# EAGLE design transistor_dc_motor_driver (EAGLE 9.6.2)
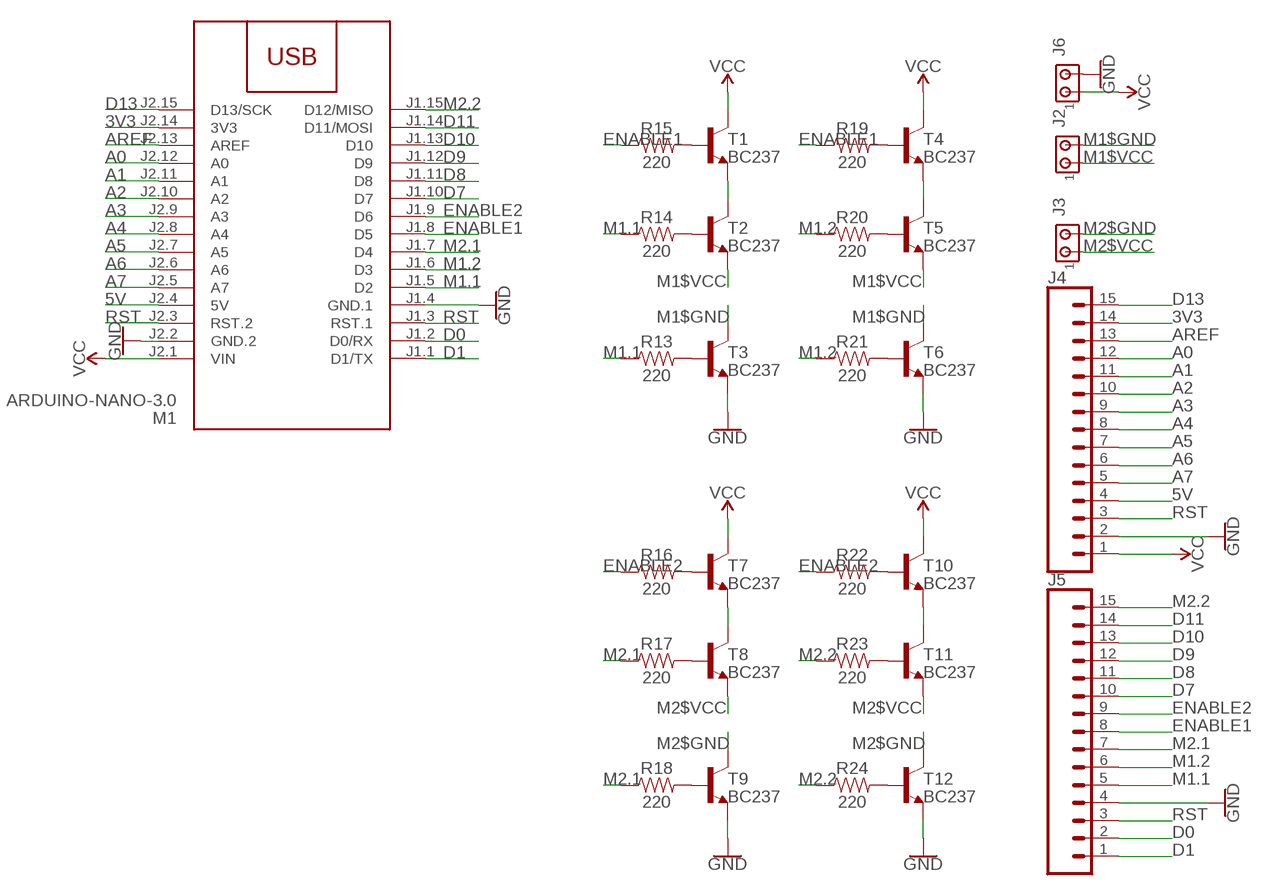
[diagram p0: schematic, sheet 1]

## Parts
J2  MTA02-156  [1X2MTA]
J3  MTA02-156  [1X2MTA]
J4  CONN_15  [1X15]
J5  CONN_15  [1X15]
J6  MTA02-156  [1X2MTA]
M1  ARDUINO-NANO-3.0  [ARDUINO-NANO-3.0]
R13  220  1KOHM-HORIZ-1/4W-5%  [AXIAL-0.3]
R14  220  1KOHM-HORIZ-1/4W-5%  [AXIAL-0.3]
R15  220  1KOHM-HORIZ-1/4W-5%  [AXIAL-0.3]
R16  220  1KOHM-HORIZ-1/4W-5%  [AXIAL-0.3]
R17  220  1KOHM-HORIZ-1/4W-5%  [AXIAL-0.3]
R18  220  1KOHM-HORIZ-1/4W-5%  [AXIAL-0.3]
R19  220  1KOHM-HORIZ-1/4W-5%  [AXIAL-0.3]
R20  220  1KOHM-HORIZ-1/4W-5%  [AXIAL-0.3]
R21  220  1KOHM-HORIZ-1/4W-5%  [AXIAL-0.3]
R22  220  1KOHM-HORIZ-1/4W-5%  [AXIAL-0.3]
R23  220  1KOHM-HORIZ-1/4W-5%  [AXIAL-0.3]
R24  220  1KOHM-HORIZ-1/4W-5%  [AXIAL-0.3]
T1  BC237  [TO92]
T2  BC237  [TO92]
T3  BC237  [TO92]
T4  BC237  [TO92]
T5  BC237  [TO92]
T6  BC237  [TO92]
T7  BC237  [TO92]
T8  BC237  [TO92]
T9  BC237  [TO92]
T10  BC237  [TO92]
T11  BC237  [TO92]
T12  BC237  [TO92]

## Nets
3V3: J4.14 M1.J2.14(3V3)
5V [5v]: J4.4 M1.J2.4(5V)
A0: J4.12 M1.J2.12(A0)
A1: J4.11 M1.J2.11(A1)
A2: J4.10 M1.J2.10(A2)
A3: J4.9 M1.J2.9(A3)
A4: J4.8 M1.J2.8(A4)
A5: J4.7 M1.J2.7(A5)
A6: J4.6 M1.J2.6(A6)
A7: J4.5 M1.J2.5(A7)
AREF: J4.13 M1.J2.13(AREF)
D0: J5.2 M1.J1.2(D0/RX)
D1: J5.1 M1.J1.1(D1/TX)
D7: J5.10 M1.J1.10(D7)
D8: J5.11 M1.J1.11(D8)
D9: J5.12 M1.J1.12(D9)
D10: J5.13 M1.J1.13(D10)
D11: J5.14 M1.J1.14(D11/MOSI)
D13: J4.15 M1.J2.15(D13/SCK)
ENABLE1: J5.8 M1.J1.8(D5) R15.P$1 R19.P$1
ENABLE2: J5.9 M1.J1.9(D6) R16.P$1 R22.P$1
GND [power]: J4.2 J5.4 J6.2 M1.J1.4(GND.1) M1.J2.2(GND.2) T3.1(E) T6.1(E) T9.1(E) T12.1(E)
M1$GND [power]: J2.2 T3.3(C) T6.3(C)
M1$VCC [power]: J2.1 T2.1(E) T5.1(E)
M1.1: J5.5 M1.J1.5(D2) R13.P$1 R14.P$1
M1.2: J5.6 M1.J1.6(D3) R20.P$1 R21.P$1
M2$GND [power]: J3.2 T9.3(C) T12.3(C)
M2$VCC [power]: J3.1 T8.1(E) T11.1(E)
M2.1: J5.7 M1.J1.7(D4) R17.P$1 R18.P$1
M2.2: J5.15 M1.J1.15(D12/MISO) R23.P$1 R24.P$1
N$1: T1.1(E) T2.3(C)
N$2: T7.1(E) T8.3(C)
N$3: T10.1(E) T11.3(C)
N$5: T4.1(E) T5.3(C)
N$6: R13.P$2 T3.2(B)
N$7: R14.P$2 T2.2(B)
N$8: R15.P$2 T1.2(B)
N$9: R16.P$2 T7.2(B)
N$10: R17.P$2 T8.2(B)
N$11: R18.P$2 T9.2(B)
N$12: R19.P$2 T4.2(B)
N$13: R20.P$2 T5.2(B)
N$14: R21.P$2 T6.2(B)
N$15: R22.P$2 T10.2(B)
N$16: R23.P$2 T11.2(B)
N$17: R24.P$2 T12.2(B)
RST: J4.3 J5.3 M1.J1.3(RST.1) M1.J2.3(RST.2)
VCC [power]: J4.1 J6.1 M1.J2.1(VIN) T1.3(C) T4.3(C) T7.3(C) T10.3(C)

## Library data of the parts
J2 J3 J6 = con-amp:MTA02-156: AMP connector
J4 J5 = SparkFun-Connectors:CONN_15: Multi connection point. Often used as Generic Header-pin footprint for 0.1 inch spaced/style header connections On any of the 0.1 inch spaced packages, you can populate with these: Break Away Headers - Straight <https://www.sparkfun.com/products/116> (PRT-00116) Break Away Male Headers - Right Angle <https://www.sparkfun.com/products/553> (PRT-00553) Female Headers <https://www.sparkfun.com/products/115> (PRT-00115) Break Away Headers - Machine Pin <https://www.sparkfun.com/products/117> (PRT-00117) Break Away Female Headers - Swiss Machine Pin <https://www.sparkfun.com/products/743> (PRT-00743) For SCREWTERMINALS and SPRING TERMINALS visit here: Screw Terimnals on SparkFun.com <https://www.sparkfun.com/search/results?term=Screw+Terminals> (5mm/3.5mm/2.54mm spacing) This device is also useful as a general connection point to wire up your design to another part of your project. Our various solder wires solder well into these plated through hole pads. Hook-Up Wire - Assortment (Stranded, 22 AWG) <https://www.sparkfun.com/products/11375> (PRT-11375) Hook-Up Wire - Assortment (Solid Core, 22 AWG) <https://www.sparkfun.com/products/11367> (PRT-11367) View the entire wire category on our website here <https://www.sparkfun.com/categories/141> Special notes: Molex polarized connector foot print use with SKU : PRT-08231 with associated crimp pins and housings. 1MM SMD Version SKU: PRT-10208 NOTES ON THE VARIANTS LOCK and LOCK_LONGPADS... This footprint was designed to help hold the alignment of a through-hole component (i.e. 6-pin header) while soldering it into place. You may notice that each hole has been shifted either up or down by 0.005 of an inch from it's more standard position (which is a perfectly straight line). This slight alteration caused the pins (the squares in the middle) to touch the edges of the holes. Because they are alternating, it causes a "brace" to hold the component in place. 0.005 has proven to be the perfect amount of "off-center" position when using our standard breakaway headers. Although looks a little odd when you look at the bare footprint, once you have a header in there, the alteration is very hard to notice. Also,if you push a header all the way into place, it is covered up entirely on the bottom side.
M1 = diy-modules:ARDUINO-NANO-3.0: Arduino Nano 3.0 and compatible devices More details available here: https://www.arduino.cc/en/Main/ArduinoBoardNano Click here to find device on ebay.com <http://www.ebay.com/sch/arduino+nano>
R13-R24 = SparkFun-Resistors:1KOHM: 1kΩ resistor A resistor is a passive two-terminal electrical component that implements electrical resistance as a circuit element. Resistors act to reduce current flow, and, at the same time, act to lower voltage levels within circuits. - Wikipedia; PROD_ID: RES-08380; VALUE: 1k
T1-T12 = transistor:BC237: NPN TRANSISTOR

## Net classes
0 default: width 0.305 mm, drill 0.508 mm, clearance 0.254 mm
1 power: width 0.889 mm, drill 0.508 mm, clearance 0.254 mm
2 5v: width 0.508 mm, drill 0.508 mm, clearance 0.254 mm

## Board
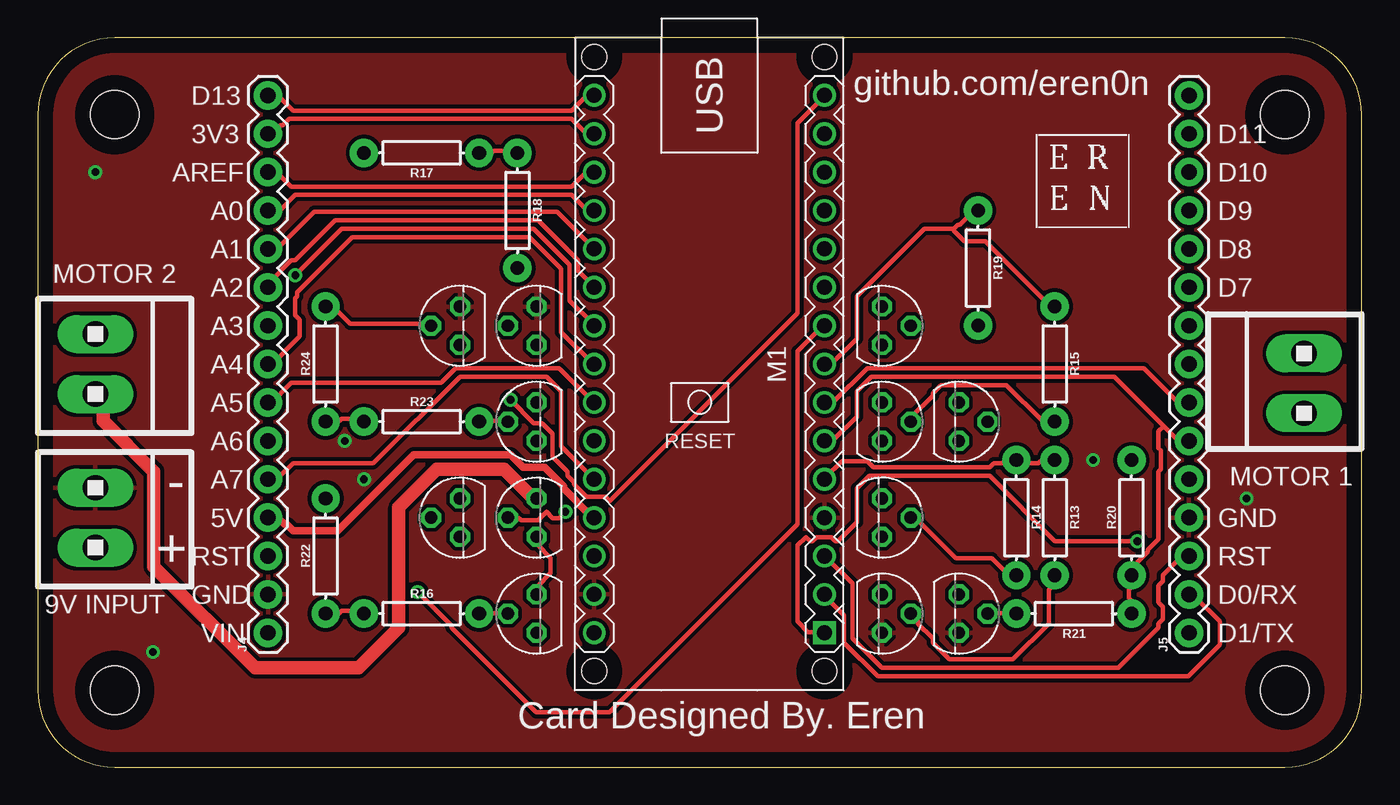
[diagram p1: board, top side]
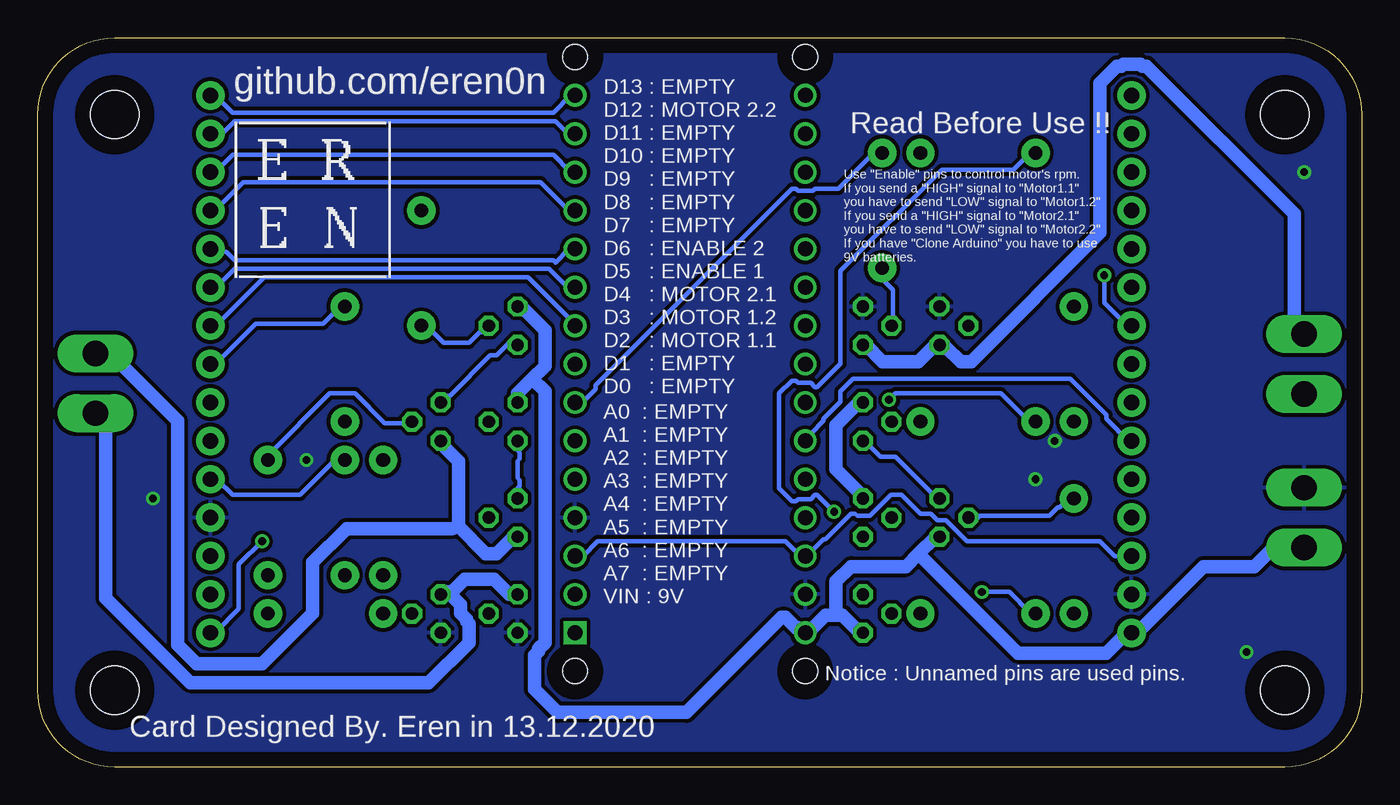
[diagram p2: board, bottom side, seen from below]

Size 87.63 x 48.26 mm. Coordinates in mm from the lower left corner, seen from the top.
Outline: 5.08,0 82.55,0 arc90 87.63,5.08 87.63,43.18 arc90 82.55,48.26 5.08,48.25 arc90 0,43.17 0,5.08 arc90 5.08,0
Copper layers (1*16): Top 0.035mm / dielectric 1.5mm / Bottom 0.035mm
Design rules "default": minimum track width 6mil, minimum drill 0.35mm, track to track 6mil, track to pad 6mil, pad to pad 6mil, via to via 6mil, smd to smd 6mil, copper to edge 40mil, drill to drill 6mil, minimum pad ring 10mil, minimum via ring 8mil, stop-mask expansion 4mil, vias tented up to drill 0mil, thermal gap 10mil
Holes 3.2 mm at 5.08,43.18 5.08,5.08 82.55,5.08 82.55,43.18

### Footprints (pad centres in the part's own frame; a part is rotated, then mirrored left to right if it is on the bottom)
1X2MTA = drill 1.676 long: 1 1.981,0; 2 -1.981,0
1X15 = drill 1.016 pad 1.88: 1 0,0; 2 2.54,0; 3 5.08,0; 4 7.62,0; 5 10.16,0; 6 12.7,0; 7 15.24,0; 8 17.78,0; 9 20.32,0; 10 22.86,0; 11 25.4,0; 12 27.94,0; 13 30.48,0; 14 33.02,0; 15 35.56,0
ARDUINO-NANO-3.0 = drill 1 square: J1.1 17.78,7.62 | drill 1: J1.2 15.24,7.62; J1.3 12.7,7.62; J1.4 10.16,7.62; J1.5 7.62,7.62; J1.6 5.08,7.62; J1.7 2.54,7.62; J1.8 0,7.62; J1.9 -2.54,7.62; J1.10 -5.08,7.62; J1.11 -7.62,7.62; J1.12 -10.16,7.62; J1.13 -12.7,7.62; J1.14 -15.24,7.62; J1.15 -17.78,7.62; J2.1 17.78,-7.62; J2.2 15.24,-7.62; J2.3 12.7,-7.62; J2.4 10.16,-7.62; J2.5 7.62,-7.62; J2.6 5.08,-7.62; J2.7 2.54,-7.62; J2.8 0,-7.62; J2.9 -2.54,-7.62; J2.10 -5.08,-7.62; J2.11 -7.62,-7.62; J2.12 -10.16,-7.62; J2.13 -12.7,-7.62; J2.14 -15.24,-7.62; J2.15 -17.78,-7.62 | hole 1.651: -20.32,7.62; -20.32,-7.62; 20.32,-7.62; 20.32,7.62
AXIAL-0.3 = drill 0.9 pad 1.88: P$1 -3.81,0; P$2 3.81,0
TO92 = drill 0.813 octagon: 1 1.27,0; 2 0,1.905; 3 -1.27,0

### Placement (x,y rotation side)
J2  83.82,25.4 90 top
J3  3.81,26.67 270 top
J4  15.24,8.89 90 top
J5  76.2,8.89 90 top
J6  3.81,16.51 270 top
M1  44.45,26.67 270 top
R13  67.31,16.51 270 top
R14  64.77,16.51 270 top
R15  67.31,26.67 270 top
R16  25.4,10.16 0 top
R17  25.4,40.64 180 top
R18  31.75,36.83 270 top
R19  62.23,33.02 270 top
R20  72.39,16.51 90 top
R21  68.58,10.16 180 top
R22  19.05,13.97 90 top
R23  25.4,22.86 0 top
R24  19.05,26.67 90 top
T1  55.88,22.86 270 top
T2  55.88,16.51 270 top
T3  55.88,10.16 270 top
T4  55.88,29.21 270 top
T5  60.96,22.86 270 top
T6  60.96,10.16 270 top
T7  33.02,10.16 90 top
T8  33.02,16.51 90 top
T9  33.02,29.21 90 top
T10  27.94,16.51 90 top
T11  33.02,22.86 90 top
T12  27.94,29.21 90 top

### Tracks (layer width: path | path; a pad name or v marks a point on that pad's centre or on a via)
3V3
  Top 0.305: M1.J2.14 36.32,41.91 35.34,42.89 16.62,42.89 16.2,42.47 16.07,42.47 15.51,41.91 J4.14
5V
  Top 0.508: M1.J2.4 36.74,16.62 36.6,16.62 34.78,18.44 34.78,18.58 33.53,19.84 32.13,19.84 31.29,20.68 24.87,20.68 19.84,15.65 16.9,15.65 16.48,16.07 16.34,16.07 15.93,16.48 15.37,16.48 J4.4
A0
  Top 0.305: M1.J2.12 36.74,36.88 36.32,36.88 35.34,37.86 17.04,37.86 16.07,36.88 15.37,36.88 J4.12
A1
  Top 0.305: M1.J2.11 36.74,34.37 34.37,36.74 18.3,36.74 15.93,34.37 15.37,34.37 J4.11
A2
  Top 0.305: M1.J2.10 36.74,31.85 35.76,32.83 35.76,33.53 33.11,36.18 19.7,36.18 17.04,33.53 16.76,33.53 15.37,32.13 15.37,31.85 J4.10
A3  (via drill 0.51)
  Top 0.305: v17.04,32.55 20.12,35.62 32.83,35.62 35.2,33.25 35.2,30.87 36.74,29.34 M1.J2.9
  Bottom 0.305: v17.04,32.55 17.04,30.73 15.65,29.34 15.37,29.34 J4.9
A4
  Top 0.305: M1.J2.8 36.74,26.68 34.65,28.78 34.65,32.97 32.55,35.06 20.82,35.06 17.18,31.43 17.18,31.15 17.04,31.01 17.04,29.9 17.32,29.62 17.32,28.5 15.37,26.54 J4.8
A5
  Top 0.305: M1.J2.7 36.74,24.17 34.51,26.4 27.66,26.4 26.68,25.43 16.76,25.43 15.37,24.03 J4.7
A6
  Bottom 0.305: M1.J2.6 36.74,21.65 36.46,21.93 36.46,22.07 35.62,22.91 35.62,23.05 34.51,24.17 34.51,24.87 33.67,25.7 19.28,25.7 16.9,23.33 16.9,23.05 15.37,21.51 J4.6
A7
  Top 0.305: M1.J2.5 34.65,21.23 34.65,24.87 33.67,25.84 27.94,25.84 22.21,20.12 16.9,20.12 15.93,19.14 15.37,19.14 J4.5
AREF
  Top 0.305: M1.J2.13 36.74,39.26 36.18,39.26 35.34,38.42 16.76,38.42 15.93,39.26 15.37,39.26 J4.13
D0
  Top 0.305: M1.J1.2 52.11,11.32 53.37,10.06 53.37,8.24 55.6,6.01 76.14,6.01 78.23,8.1 78.23,9.64 76.56,11.32 76.28,11.32 J5.2
D1  (via drill 0.51)
  Top 0.305: v72.78,14.95 67.33,14.95 63.01,19.28 55.04,19.28 54.2,18.44 54.2,16.2 52.95,14.95 52.81,14.95 52.53,15.23 51.55,15.23 51.27,14.95 51.13,14.95 50.85,15.23 50.29,14.67 50.29,9.64 50.99,8.94 51.97,8.94 M1.J1.1
  Bottom 0.305: v72.78,14.95 74.32,13.41 74.32,10.48 75.86,8.94 76.14,8.94 J5.1
D7
  Bottom 0.305: M1.J1.10 52.11,31.85 52.67,31.85 53.78,32.97 74.6,32.97 75.72,31.85 76.14,31.85 J5.10
D8
  Bottom 0.305: J5.11 76,34.09 75.16,34.09 74.6,33.53 53.51,33.53 53.37,33.39 52.53,34.23 52.11,34.23 M1.J1.11
D9
  Bottom 0.305: M1.J1.12 52.11,36.88 52.53,36.88 54.34,38.7 74.04,38.7 75.86,36.88 76.14,36.88 J5.12
D10
  Bottom 0.305: M1.J1.13 52.11,39.4 52.39,39.4 53.51,40.51 74.74,40.51 75.86,39.4 76.14,39.4 J5.13
D11
  Bottom 0.305: M1.J1.14 52.53,41.91 53.37,42.75 74.6,42.75 75.44,41.91 J5.14
D13
  Top 0.305: M1.J2.15 36.74,44.42 36.32,44.42 35.34,43.45 16.9,43.45 15.93,44.42 15.37,44.42 J4.15
ENABLE1
  Top 0.305: 60.63,35.62 58.67,35.62 54.2,31.15 54.2,28.36 52.53,26.68 52.11,26.68 M1.J1.8 | 60.63,35.62 60.91,35.9 61.05,35.9 61.89,36.74 62.17,36.74 R19.P$1 | R15.P$1 67.2,30.59 66.92,30.59 62.73,34.78 61.33,34.78 60.63,35.48 60.63,35.62
  Bottom 0.305: J5.8 76.14,26.68 75.86,26.68 73.2,29.34 68.73,29.34 67.61,30.45 67.33,30.45 R15.P$1
ENABLE2  (via drill 0.51)
  Top 0.305: R22.P$1 19.14,10.2 19.98,10.2 20.12,10.34 21.37,10.34 21.51,10.2 R16.P$1 | v25.15,11.6 27.38,9.36 27.38,9.22 32.97,3.63 37.86,3.63 50.29,16.07 50.29,27.52 51.97,29.2 M1.J1.9
  Bottom 0.305: M1.J1.9 52.11,29.34 55.18,32.41 72.64,32.41 75.72,29.34 76.14,29.34 J5.9 | v25.15,11.6 23.33,11.6 21.93,10.2 21.65,10.2 R16.P$1
GND  (via drill 0.51)
  other vias: 7.62,7.62 69.85,20.32 80.01,17.78 20.32,21.59 21.59,19.05 3.81,39.37
  pour Bottom: -1.27,49.53 -1.27,-1.27 88.9,-1.27 88.9,49.53
  pour Top: -1.27,49.53 -1.27,-1.27 88.9,-1.27 88.9,49.53
M1$GND
  Bottom 0.889: 60.21,11.6 59.37,12.43 57.42,12.43 56.44,11.46 55.88,11.46 T3.3 | 60.21,11.6 60.63,11.6 60.91,11.32 T6.3 | 60.21,11.6 60.07,11.18 59.65,10.76 59.65,10.2 59.23,9.78 59.23,9.64 59.09,9.5 59.09,8.24 61.75,5.59 77.53,5.59 83.12,11.18 83.12,22.63 83.82,23.33 J2.2
M1$VCC
  Bottom 0.889: 59.79,15.93 57.98,14.11 57.28,14.11 56.16,15.23 55.88,15.23 T2.1 | 59.79,15.93 59.79,20.26 61.05,21.51 T5.1 | J2.1 82.84,27.38 78.37,22.91 78.37,8.1 77.11,6.84 72.78,6.84 69.43,10.2 69.43,13.55 67.2,15.79 60.21,15.79 59.79,15.93
M1.1
  Top 0.305: M1.J1.5 52.11,19.14 53.23,20.26 54.9,20.26 55.32,19.84 63.01,19.84 63.28,20.12 63.84,20.12 63.98,20.26 64.68,20.26 R14.P$1 64.68,20.12 66.22,20.12 66.36,20.26 67.2,20.26 R13.P$1
  Bottom 0.305: J5.5 76.14,19 75.72,19 74.74,18.02 70.27,18.02 68.03,20.26 67.33,20.26 R13.P$1
M1.2
  Top 0.305: R21.P$1 72.36,10.2 72.36,11.04 72.22,11.18 72.22,11.73 72.36,11.87 72.36,12.57 R20.P$1 72.36,12.85 72.36,13.13 73.48,14.25 73.48,14.39 74.18,15.09 74.18,19.56 74.32,19.7 74.32,20.95 74.18,21.09 74.18,22.21 74.53,22.56 | 74.53,22.56 75.44,21.65 76.14,21.65 J5.6 | 74.53,22.56 71.25,25.84 55.18,25.84 54.2,24.87 54.2,23.19 52.67,21.65 52.11,21.65 M1.J1.6
M2$GND
  Bottom 0.889: T9.3 32.83,27.94 31.71,26.82 29.34,26.82 28.22,27.94 T12.3 27.52,27.8 26.54,26.82 25.84,26.82 17.32,35.34 17.32,45.26 16.2,46.38 15.93,46.38 15.79,46.52 14.67,46.52 14.53,46.38 14.25,46.38 4.47,36.6 4.47,29.34 3.91,28.78 J3.2
M2$VCC
  Top 0.889: J3.1 4.33,24.17 4.33,22.91 7.68,19.56 7.68,13.27 14.39,6.57 21.23,6.57 23.89,9.22 23.89,17.18 26.4,19.7 30.87,19.7 32.69,17.88 32.97,17.88 T8.1
  Bottom 0.889: T8.1 33.11,17.88 33.11,18.02 34.78,19.7 34.78,22.63 33.11,24.31 32.97,24.17 T11.1
M2.1
  Top 0.305: R17.P$1 29.34,40.65 30.04,40.65 30.18,40.79 31.57,40.79 31.71,40.65 R18.P$1 | M1.J1.7 52.11,24.17 52.67,24.17 54.9,26.4 73.2,26.4 75.44,24.17 76.14,24.17 J5.7
  Bottom 0.305: R18.P$1 31.85,40.51 32.41,40.51 34.65,38.28 36.18,38.28 36.32,38.14 37.3,38.14 37.44,38.28 37.72,38.28 50.71,25.29 50.71,25.01 51.55,24.17 51.97,24.17 M1.J1.7
M2.2  (via drill 0.51)
  Top 0.305: R24.P$1 19.14,22.91 19.98,22.91 20.12,23.05 20.68,23.05 20.82,22.91 21.51,22.91 R23.P$1 | v31.29,24.31 32.83,22.77 33.39,22.77 34.09,22.07 34.09,20.54 35.06,19.56 35.06,19.28 35.48,18.86 35.48,18.72 36.32,17.88 37.58,17.88 37.86,17.6 50.29,30.04 50.29,42.61 52.11,44.42 M1.J1.15
  Bottom 0.305: M1.J1.15 52.11,44.42 52.39,44.42 53.51,43.31 74.74,43.31 75.86,44.42 76.14,44.42 J5.15 | v31.29,24.31 30.87,24.73 23.89,24.73 22.07,22.91 21.65,22.91 R23.P$1
N$1
  Bottom 0.305: T2.3 55.88,18.44 55.74,18.58 55.74,19 55.88,19.14 55.88,20.26 55.74,20.4 55.74,20.82 55.88,20.95 T1.1
N$2
  Top 0.305: T7.1 33.11,11.46 33.11,12.01 33.95,12.85 33.95,13.83 33.11,14.67 33.11,15.23 T8.3
N$3
  Bottom 0.305: T10.1 27.94,17.88 28.22,17.88 30.87,20.54 31.85,20.54 32.97,21.65 T11.3
N$5
  Bottom 0.305: T4.1 56.02,28.08 56.44,28.08 57.28,27.24 57.7,27.24 60.35,24.59 60.49,24.59 60.91,24.17 T5.3
N$6
  Top 0.305: T3.2 57.84,10.06 58.26,9.64 58.26,9.5 59.23,8.52 59.23,8.24 60.35,7.12 64.54,7.12 66.92,9.5 66.92,11.73 67.2,12.01 67.2,12.57 R13.P$2
N$7
  Top 0.305: T2.2 57.84,16.48 58.12,16.48 60.77,13.83 63.14,13.83 64.26,12.71 64.68,12.71 R14.P$2
N$8
  Top 0.305: T1.2 57.84,22.91 57.84,23.19 59.23,24.59 59.23,24.73 59.79,25.29 64.12,25.29 66.5,22.91 67.2,22.91 R15.P$2
N$9
  Top 0.305: T7.2 31.01,10.2 29.34,10.2 R16.P$2
N$10  (via drill 0.51)
  Top 0.305: v34.92,16.9 34.51,16.48 34.09,16.48 33.67,16.9 33.11,16.34 31.99,16.34 31.85,16.48 31.15,16.48 T8.2
  Bottom 0.305: v34.92,16.9 36.04,18.02 36.18,18.02 36.46,17.74 37.3,17.74 37.44,17.6 37.72,17.6 38.56,18.44 38.56,24.73 37.72,25.57 37.44,25.57 37.3,25.43 36.46,25.43 36.18,25.15 36.04,25.15 34.51,26.68 34.51,32.83 27.8,39.53 23.05,39.53 22.07,40.51 21.65,40.51 R17.P$2
N$11
  Bottom 0.305: T9.2 31.01,29.34 31.01,31.57 31.71,32.27 31.71,32.97 R18.P$2
N$12
  Bottom 0.305: T4.2 57.84,29.2 58.26,28.78 58.4,28.78 59.09,28.08 60.77,28.08 61.89,29.2 62.17,29.2 R19.P$2
N$13
  Bottom 0.305: T5.2 62.87,22.77 64.68,22.77 66.64,24.73 68.31,24.73 72.36,20.68 72.36,20.4 R20.P$2
N$14
  Top 0.305: T6.2 62.87,10.2 64.68,10.2 R21.P$2
N$15
  Bottom 0.305: T10.2 25.98,16.48 25.43,16.48 25.29,16.62 20.68,16.62 20.12,17.18 19.98,17.18 19.42,17.74 19.14,17.74 R22.P$2
N$16
  Top 0.305: T11.2 31.01,22.91 29.34,22.91 R23.P$2
N$17
  Top 0.305: T12.2 25.98,29.2 25.43,29.2 25.29,29.34 20.68,29.34 19.56,30.45 19.14,30.45 R24.P$2
RST
  Top 0.305: J5.3 75.72,13.97 74.46,12.71 74.46,12.29 74.18,12.01 74.18,10.9 74.46,10.62 74.46,9.78 74.18,9.5 74.18,9.22 71.53,6.57 55.88,6.57 53.92,8.52 53.92,12.15 52.11,13.97 M1.J1.3
  Bottom 0.305: M1.J1.3 51.55,13.97 50.57,14.95 38.14,14.95 37.16,13.97 M1.J2.3 36.74,13.97 35.62,15.09 35.48,15.09 33.81,16.76 33.53,16.76 33.39,16.62 32.55,16.62 31.15,18.02 30.45,18.02 29.2,16.76 28.5,16.76 28.08,16.34 27.52,16.34 26.12,14.95 17.32,14.95 16.34,13.97 J4.3
VCC
  Bottom 0.889: J6.1 5.87,14.53 7.12,13.27 10.48,13.27 14.81,8.94 15.23,8.94 J4.1 15.65,8.8 16.9,7.54 22.77,7.54 29.34,14.11 | T1.3 55.88,24.73 54.9,25.7 | 54.9,25.7 54.06,26.54 54.06,28.92 55.6,30.45 55.88,30.45 T4.3 | 34.78,10.06 35.48,10.06 36.74,8.8 M1.J2.1 37.16,9.08 37.3,9.22 37.44,9.22 38.14,9.92 38.42,9.92 44.7,3.63 53.23,3.63 54.76,5.17 54.76,7.4 54.48,7.68 54.48,7.82 54.06,8.24 54.06,24.87 54.9,25.7 | 34.78,10.06 34.37,10.06 33.25,8.94 33.11,8.94 T7.3 | 29.34,14.11 30.18,13.27 33.81,13.27 34.78,12.29 34.78,10.06 | 29.34,14.11 28.22,15.23 27.94,15.23 T10.3

### Text on the board
tPlace: D13 | github.com/eren0n | 3V3 | D11 | AREF | D10 | A0 | D9 | A1 | D8 | MOTOR 2 | A2 | D7 | A3 | A4 | A5 | A6 | - | MOTOR 1 | A7 | + | 5V | GND | RST | RST | GND | D0/RX | 9V INPUT | VIN | D1/TX | Card Designed By. Eren
bPlace: github.com/eren0n | Read Before Use !! | Use "Enable" pins to control motor's rpm. / If you send a "HIGH" signal to "Motor1.1" / you have to send "LOW" signal to "Motor1.2" / If you send a "HIGH" signal to "Motor2.1" / you have to send "LOW" signal to "Motor2.2" / If you have "Clone Arduino" you have to use / 9V batteries. | D13 : EMPTY / D12 : MOTOR 2.2 / D11 : EMPTY / D10 : EMPTY / D9 : EMPTY / D8 : EMPTY / D7 : EMPTY / D6 : ENABLE 2 / D5 : ENABLE 1 / D4 : MOTOR 2.1 / D3 : MOTOR 1.2 / D2 : MOTOR 1.1 / D1 : EMPTY / D0 : EMPTY | A0 : EMPTY / A1 : EMPTY / A2 : EMPTY / A3 : EMPTY / A4 : EMPTY / A5 : EMPTY / A6 : EMPTY / A7 : EMPTY / VIN : 9V | Notice : Unnamed pins are used pins. | Card Designed By. Eren in 13.12.2020